# Altium project ThermoE.PrjPcb
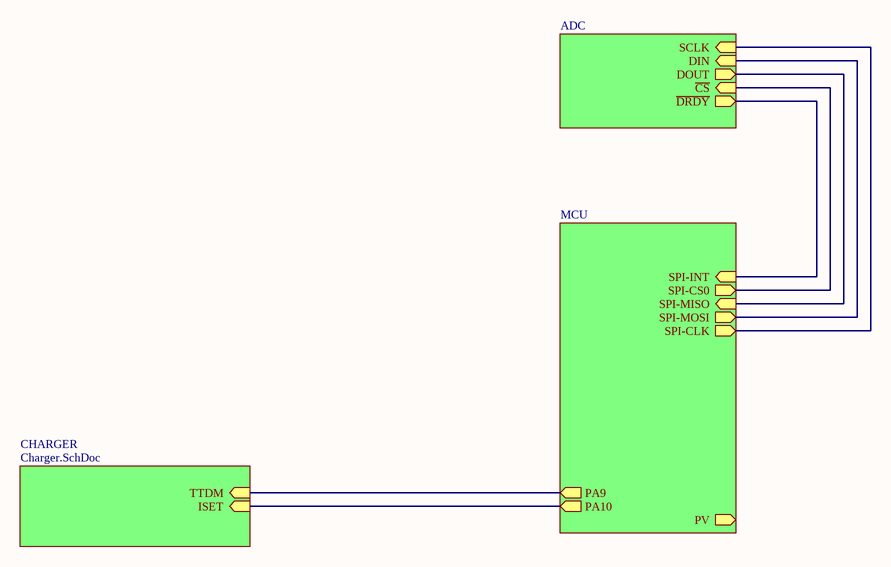
[diagram p0: MAIN.SchDoc]
4 sheets, 65 parts. Net scope: hierarchical (ports join the sheet entries above them; power ports are global).
Board file: ThermoE.PcbDoc
Sheets:
  MAIN.SchDoc
    ADC = ThermoE.SchDoc
    MCU = STM32F030C8T6.SchDoc
    CHARGER = Charger.SchDoc

## Sheet MAIN.SchDoc
size A4; SheetNumber: 1; SheetTotal: 4

### Sub-sheets
ADC = ThermoE.SchDoc: SCLK (in), DIN (in), ~{CS} (in), DOUT (out), ~{DRDY} (out)
CHARGER = Charger.SchDoc: TTDM (in), ISET (in)
MCU = STM32F030C8T6.SchDoc: SPI-MOSI (out), SPI-CS0 (out), SPI-MISO (in), SPI-CLK (out), SPI-INT (in), PV (out), PA9 (out), PA10 (out)

### Nets
ISET: sheet MCU/PA10, sheet CHARGER/ISET
SPI-CLK: sheet ADC/SCLK, sheet MCU/SPI-CLK
SPI-CS0: sheet ADC/~{CS}, sheet MCU/SPI-CS0
SPI-INT: sheet ADC/~{DRDY}, sheet MCU/SPI-INT
SPI-MISO: sheet ADC/DOUT, sheet MCU/SPI-MISO
SPI-MOSI: sheet ADC/DIN, sheet MCU/SPI-MOSI
TS: sheet MCU/PA9, sheet CHARGER/TTDM

## Sheet ThermoE.SchDoc
size A4; SheetNumber: 2; SheetTotal: 3
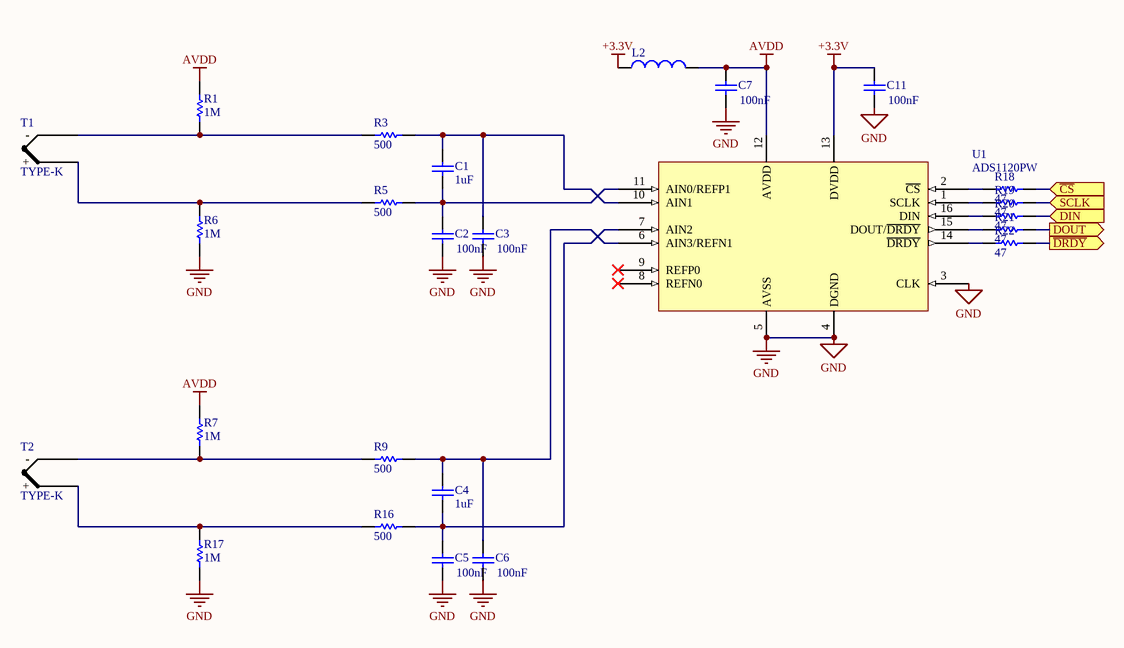
[diagram p1: ThermoE.SchDoc]

### Parts
C1  1uF  [c603]
C2  100nF  [c603]
C3  100nF  [c603]
C4  1uF  [c603]
C5  100nF  [c603]
C6  100nF  [c603]
C7  100nF  [C603]
C11  100nF  [C603]
L2  1K  [r805]  (value not drawn)
R1  1M  [R0603]
R3  500  [R0603]
R5  500  [R0603]
R6  1M  [R0603]
R7  1M  [R0603]
R9  500  [R0603]
R16  500  [R0603]
R17  1M  [R0603]
R18  47  [R0603]
R19  47  [R0603]
R20  47  [R0603]
R21  47  [R0603]
R22  47  [R0603]
T1  TYPE-K  [PCC-SMP]
T2  TYPE-K  [PCC-SMP]
U1  ADS1120PW  [TSSOP-16]

### Ports
DIN (in), DOUT (out), SCLK (in), ~{CS} (in), ~{DRDY} (out)

### Nets
+3.3V: C11.2 L2.1 U1.13(DVDD)
AVDD: C7.2 L2.2 R1.2 R7.2 U1.12(AVDD)
GND: C2.1 C3.1 C5.1 C6.1 C7.1 C11.1 R6.1 R17.1 U1.3(CLK) U1.4(DGND) U1.5(AVSS)
SPI-CLK: R19.1 ; port SCLK
SPI-CS0: R18.1 ; port ~{CS}
SPI-INT: R22.1 ; port ~{DRDY}
SPI-MISO: R21.1 ; port DOUT
SPI-MOSI: R20.1 ; port DIN
NetC1_1: C1.1 C2.2 R5.1 U1.11(AIN0/REFP1)
NetC1_2: C1.2 C3.2 R3.1 U1.10(AIN1)
NetC4_1: C4.1 C5.2 R16.1 U1.7(AIN2)
NetC4_2: C4.2 C6.2 R9.1 U1.6(AIN3/REFN1)
NetR1_1: R1.1 R3.2 T1.1(-)
NetR5_2: R5.2 R6.2 T1.2(+)
NetR7_1: R7.1 R9.2 T2.1(-)
NetR16_2: R16.2 R17.2 T2.2(+)
NetR18_2: R18.2 U1.2(~{CS})
NetR19_2: R19.2 U1.1(SCLK)
NetR20_2: R20.2 U1.16(DIN)
NetR21_2: R21.2 U1.15(DOUT/~{DRDY})
NetR22_2: R22.2 U1.14(~{DRDY})

Not connected (* = marked no-connect by the designer): U1 8(REFN0)* 9(REFP0)*

### Library data of the parts
C1-C7 C11 = Cap: Capacitor; Designer: Parsa Malekpour
  C1 C4: Value: 1uF
  C2 C3 C5-C7 C11: Value: 100nF
L2 = Ferrite Bead: Code_IEC: 1005; Published: 8-Jun-2000; LatestRevisionDate: 29-May-2009; LatestRevisionNote: IPC-7351 Footprint Added.; Publisher: Altium Limited; PackageDescription: Chip Inductor; Code_JEITA: 0402; Value: 1K
R1 R3 R5-R7 R9 R16-R22 = Resistor: Designer: Parsa Malekpour
  R1 R6 R7 R17: Value: 1M
  R3 R5 R9 R16: Value: 500
  R18-R22: Value: 47
T1 T2 = THERMOCOUPLE
U1 = ADS1120PW: ADS1120 4-Channel, 2-kSPS, Low-Power, 16-Bit ADC with Integrated PGA and Reference

## Sheet STM32F030C8T6.SchDoc
size A4; SheetNumber: 3; SheetTotal: 4
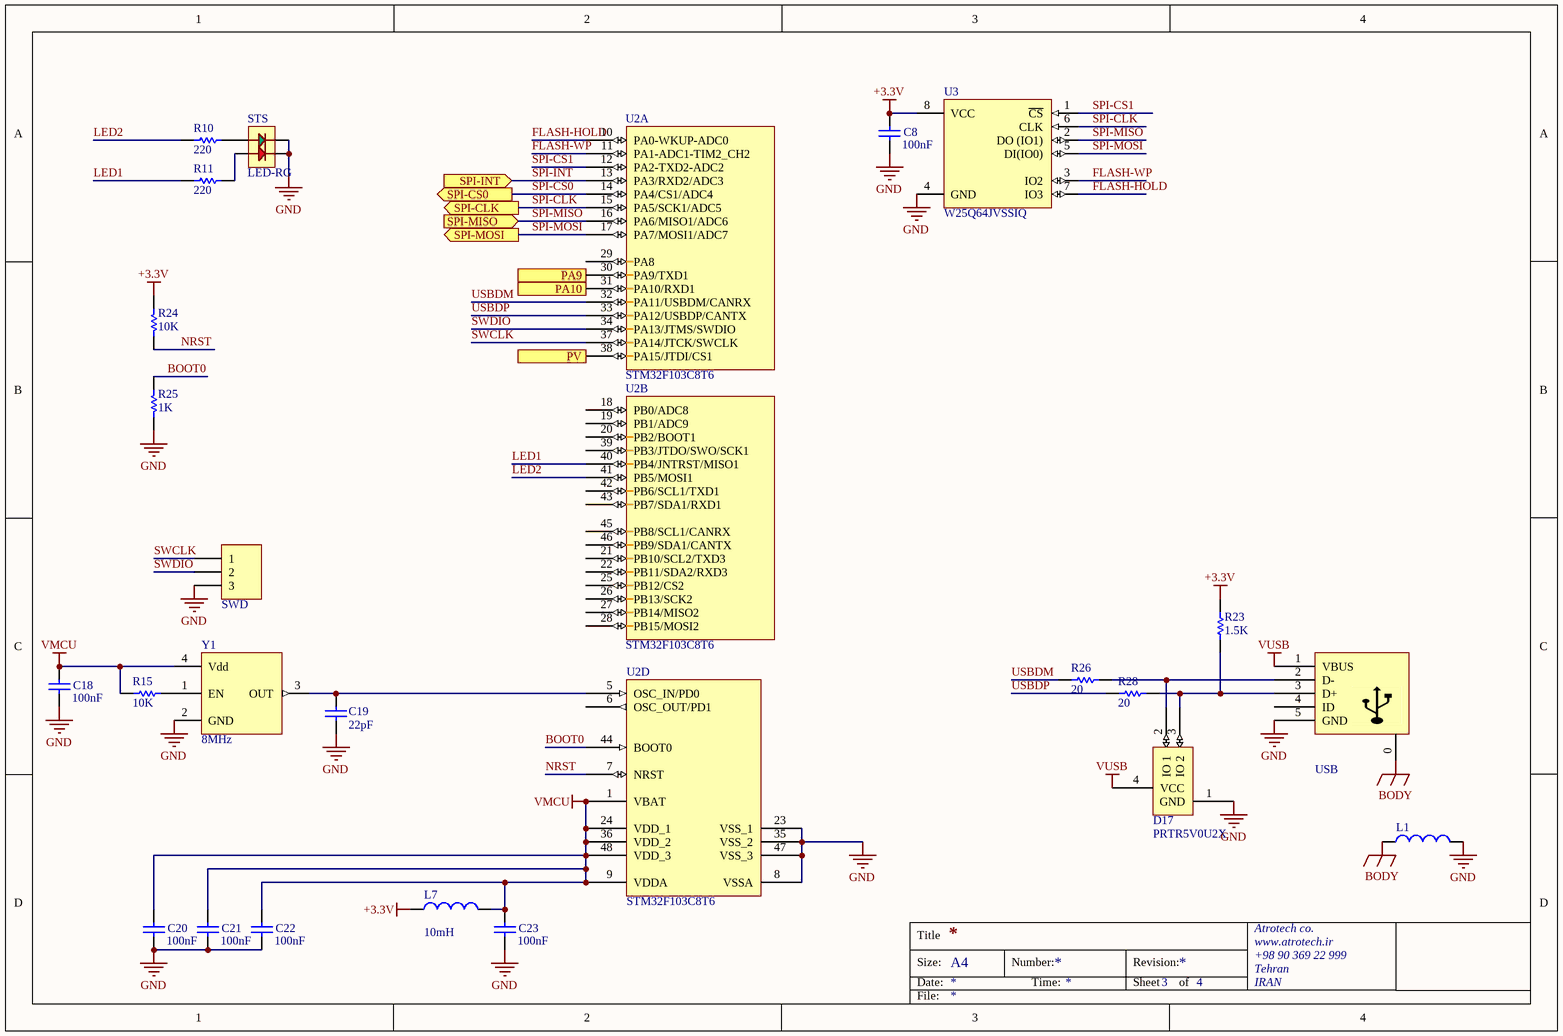
[diagram p2: STM32F030C8T6.SchDoc]

### Parts
C8  100nF  [C603]
C18  100nF  [C603]
C19  22pF  [C603]
C20  100nF  [C603]
C21  100nF  [C603]
C22  100nF  [C603]
C23  100nF  [C603]
D17  PRTR5V0U2X  [SOT-143B]
L1  Inductor  [R805]  (value not drawn)
L7  value 10mH  [R805]  (hidden comment: Inductor)
R10  220  [R0603]
R11  220  [R0603]
R15  10K  [R0603]
R23  1.5K  [R0603]
R24  10K  [R0603]
R25  1K  [R0603]
R26  20  [R0603]
R28  20  [R0603]
STS  LED-RG  [LED-1210]
SWD  CONN-3  [PHDR3]  (value not drawn)
U2  STM32F103C8T6  [LQFP-48]  (parts A,B,D of 4)
U3  W25Q64JVSSIQ  [SOIC-8W]
USB  USB MINI  [USB-MINI-SMD]  (value not drawn)
Y1  8MHz  [ASV]

### Ports
PA9 (out), PA10 (out), PV (out), SPI-CLK (out), SPI-CS0 (out), SPI-INT (in), SPI-MISO (in), SPI-MOSI (out)

### Nets
+3.3V: C8.2 L7.1 R23.1 R24.2 U3.8(VCC)
BODY: L1.1 USB.0(BODY)
GND: C8.1 C18.1 C19.2 C20.1 C21.1 C22.1 C23.1 D17.1(GND) L1.2 R25.1 STS.3(RED-C) STS.4(GRN-C) SWD.3 U2.8(VSSA) U2.23(VSS_1) U2.35(VSS_2) U2.47(VSS_3) U3.4(GND) USB.5(GND) Y1.2(GND)
VMCU: C18.2 C20.2 C21.2 C22.2 C23.2 L7.2 R15.2 U2.1(VBAT) U2.9(VDDA) U2.24(VDD_1) U2.36(VDD_2) U2.48(VDD_3) Y1.4(Vdd)
VUSB: D17.4(VCC) USB.1(VBUS)
BOOT0: R25.2 U2.44(BOOT0)
FLASH-HOLD: U2.10(PA0-WKUP-ADC0) U3.7(IO3)
FLASH-WP: U2.11(PA1-ADC1-TIM2_CH2) U3.3(IO2)
ISET: U2.31(PA10/RXD1) ; port PA10
LED1: R11.2 U2.40(PB4/JNTRST/MISO1)
LED2: R10.2 U2.41(PB5/MOSI1)
NRST: R24.1 U2.7(NRST)
SPI-CLK: U2.15(PA5/SCK1/ADC5) U3.6(CLK) ; port SPI-CLK
SPI-CS0: U2.14(PA4/CS1/ADC4) ; port SPI-CS0
SPI-CS1: U2.12(PA2-TXD2-ADC2) U3.1(~{CS})
SPI-INT: U2.13(PA3/RXD2/ADC3) ; port SPI-INT
SPI-MISO: U2.16(PA6/MISO1/ADC6) U3.2(DO_(IO1)) ; port SPI-MISO
SPI-MOSI: U2.17(PA7/MOSI1/ADC7) U3.5(DI(IO0)) ; port SPI-MOSI
SWCLK: SWD.1 U2.37(PA14/JTCK/SWCLK)
SWDIO: SWD.2 U2.34(PA13/JTMS/SWDIO)
TS: U2.30(PA9/TXD1) ; port PA9
USBDM: R26.2 U2.32(PA11/USBDM/CANRX)
USBDP: R28.2 U2.33(PA12/USBDP/CANTX)
NetC19_1: C19.1 U2.5(OSC_IN/PD0) Y1.3(OUT)
NetD17_2: D17.2(IO_1) R26.1 USB.2(D-)
NetD17_3: D17.3(IO_2) R23.2 R28.1 USB.3(D+)
NetR10_1: R10.1 STS.1(GRN-A)
NetR11_1: R11.1 STS.2(RED-A)
NetR15_1: R15.1 Y1.1(EN)
NetU2_38: U2.38(PA15/JTDI/CS1) ; port PV

Not connected (* = marked no-connect by the designer): U2 6(OSC_OUT/PD1) 18(PB0/ADC8) 19(PB1/ADC9) 20(PB2/BOOT1) 21(PB10/SCL2/TXD3) 22(PB11/SDA2/RXD3) 25(PB12/CS2) 26(PB13/SCK2) 27(PB14/MISO2) 28(PB15/MOSI2) 29(PA8) 39(PB3/JTDO/SWO/SCK1) 42(PB6/SCL1/TXD1) 43(PB7/SDA1/RXD1) 45(PB8/SCL1/CANRX) 46(PB9/SDA1/CANTX); USB 4(ID)

### Notes on the sheet
- Title
- Size:
- Date:
- A4
- Number:
- Time:
- Revision:
- Sheet
- of
- Atrotech co.
- www.atrotech.ir
- +98 90 369 22 999
- Tehran
- IRAN
- File:

### Library data of the parts
C8 C18-C23 = Cap: Capacitor; Designer: Parsa Malekpour
  C8 C18 C20-C23: Value: 100nF
  C19: Value: 22pF
D17 = PRTR5V0U2X: Ultra low capacitance double rail-to-rail ESD protection diode; reverse standoff voltage: 5.5V
L1 = Inductor: Code_IEC: 1005; Value: 10mH; Published: 8-Jun-2000; LatestRevisionDate: 29-May-2009; LatestRevisionNote: IPC-7351 Footprint Added.; PackageReference: 0402-A; Publisher: Altium Limited; PackageDescription: Chip Inductor; Code_JEITA: 0402
L7 = Inductor: Code_IEC: 1005; Published: 8-Jun-2000; LatestRevisionDate: 29-May-2009; LatestRevisionNote: IPC-7351 Footprint Added.; PackageReference: 0402-A; Publisher: Altium Limited; PackageDescription: Chip Inductor; Code_JEITA: 0402
R10 R11 R15 R23-R26 R28 = Resistor: Designer: Parsa Malekpour
  R10 R11: Value: 220
  R15 R24: Value: 10K
  R23: Value: 1.5K
  R25: Value: 1K
  R26 R28: Value: 20
STS = LED-RG-4
SWD = CONN-3: Header, 3-Pin
U2 = STM32F103C8T6: STM32 ARM-based 32-bit MCU with 64 Kbytes Flash, 48-pin LQFP, Industrial Temperature; Published: 30-May-2008; DatasheetVersion: rev6, Mar-2008; PackageVersion: Mar-2008; PackageReference: LQFP48; Publisher: Altium Limited; PackageDescription: 48-Pin Low-Profile Quad Flat Pack, 7 x 7 mm Body, 0.5 mm Pitch (LQFP48); ComponentLink1Description: Manufacturer Link; ComponentLink1URL: www.st.com/stm32; ComponentLink2Description: Datasheet; ComponentLink2URL: http://www.st.com/stonline/products/literature/ds/13587.pdf
Y1 = OSCILLATOR: Frequency: 8MHz

## Sheet Charger.SchDoc
size A; SheetNumber: 4; SheetTotal: 4
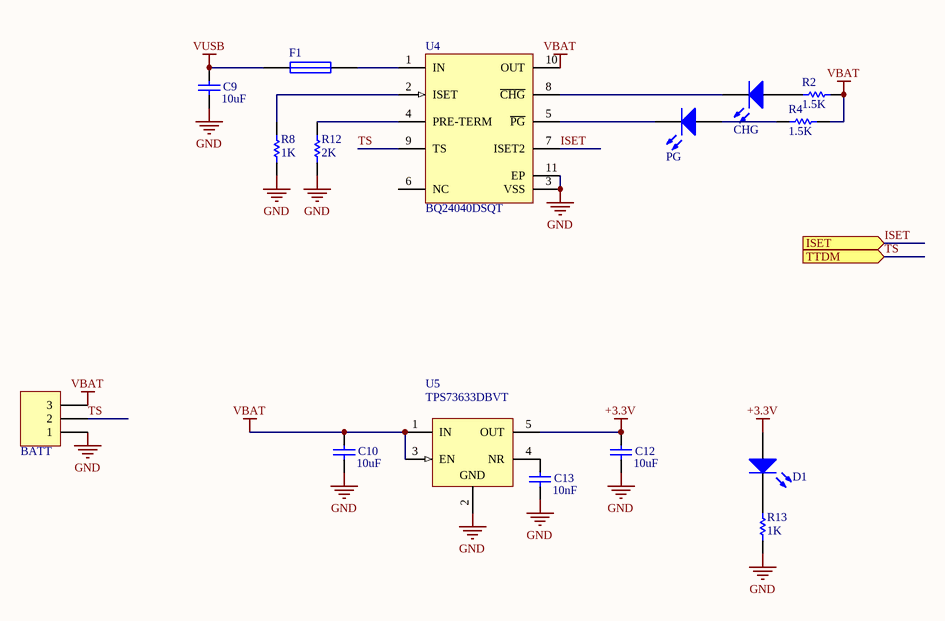
[diagram p3: Charger.SchDoc]

### Parts
BATT  CONN-3  [PicoBlade-3-S]  (value not drawn)
C9  10uF  [C805]
C10  10uF  [C805]
C12  10uF  [C805]
C13  10nF  [C603]
CHG  LED  [led-0603]  (value not drawn)
D1  LED  [led-0603]  (value not drawn)
F1  Fuse 1  [ptc-0805]  (value not drawn)
PG  LED  [led-0603]  (value not drawn)
R2  1.5K  [R0603]
R4  1.5K  [R0603]
R8  1K  [R0603]
R12  2K  [R0603]
R13  1K  [R0603]
U4  BQ24040DSQT  [SON40P200X200X80-11N]
U5  TPS73633DBVT  [DBV0005A_M]

### Ports
ISET (in), TTDM (in)

### Nets
+3.3V: C12.2 D1.1(A) U5.5(OUT)
GND: BATT.1 C9.1 C10.1 C12.1 C13.1 R8.2 R12.2 R13.2 U4.3(VSS) U4.11(EP) U5.2(GND)
VBAT: BATT.3 C10.2 R2.2 R4.2 U4.10(OUT) U5.1(IN) U5.3(EN)
VUSB: C9.2 F1.1
ISET: U4.7(ISET2) ; port ISET
TS: BATT.2 U4.9(TS) ; port TTDM
NetC13_2: C13.2 U5.4(NR)
NetCHG_1: CHG.1(A) R2.1
NetCHG_2: CHG.2(K) U4.8(~{CHG})
NetD1_2: D1.2(K) R13.1
NetF1_2: F1.2 U4.1(IN)
NetPG_1: PG.1(A) R4.1
NetPG_2: PG.2(K) U4.5(~{PG})
NetR8_1: R8.1 U4.2(ISET)
NetR12_1: R12.1 U4.4(PRE-TERM)

Not connected (* = marked no-connect by the designer): U4 6(NC)

### Library data of the parts
BATT = CONN-3: Header, 3-Pin
C9 C10 C12 C13 = Cap: Capacitor; Designer: Parsa Malekpour
  C9 C10 C12: Value: 10uF
  C13: Value: 10nF
F1 = Fuse 1: Fuse; Published: 8-Jun-2000; LatestRevisionDate: 17-Jul-2002; LatestRevisionNote: Re-released for DXP Platform.; PackageReference: PIN-W2/E2.8; Publisher: Altium Limited; PackageDescription: Thru-Hole; 2 Leads
R2 R4 R8 R12 R13 = Resistor: Designer: Parsa Malekpour
  R2 R4: Value: 1.5K
  R8 R13: Value: 1K
  R12: Value: 2K
U4 = CMP-0321-00457-2: 800 mA, Single-Input, Single Cell Li-Ion Battery Charger with Auto Start. Vovp=6.6 V, 3.5 V, -40 to 85 degC, 10-pin SON (DSQ), Green (RoHS & no Sb/Br); Manufacturer: Texas Instruments; Lead Acid: N; SubFamily: Battery Charge Management; Vin(Min)(V): 3.5; PackageReference: DSQ0010A; NiMH: N; DatasheetVersion: SLUS941A; Over Voltage Protection: N; PackageDescription: 10-Pin Plastic Small Outline No-Lead, 2 x 2 x 0.8 mm Body, 0.4 mm Pitch, Exposed Pad; Li-Polymer: N; Li-Ion: N; ComponentLink1Description: Datasheet; ComponentLink1URL: http://www.ti.com/general/docs/lit/getliterature.tsp?genericPartNumber=BQ24040&fileType=pdf; PartNumber: BQ24040DSQT; NiCd: N; Eco-Plan: Green (RoHS & no Sb/Br); Mounting Technology: Surface Mount; PackageVersion: revB, Apr-2010
U5 = CMP-0395-00251-2: Single Output Low Noise LDO, 400 mA, Fixed 3.3 V Output, 1.7 to 5.5 V Input, with Reverse Current Protection, 5-pin SOT-23 (DBV), -40 to 85 degC, Green (RoHS & no Sb/Br); Manufacturer: Texas Instruments; Vin(Min)(V): 1.7; Vin(Max)(V): 5.5; Vout Adj(Min)(V): 3.3; Accuracy(%): 1; SubFamily: Single Channel LDO; Rating: Catalog; Iout(Max)(A): 0.4; Iq(Typ)(mA): 0.3; Vdo(Typ)(mV): 75; ComponentLink1URL: http://www.ti.com/; ComponentLink4URL: Samples URL:http://www.ti.com/product/tps73633#samples; ComponentLink2Description: Datasheet; ComponentLink3URL: http://www.ti.com/litv/pdf/mpds018i; Code_JEDEC: MO-178; ComponentLink4Description: URL Link1; Eco-Plan: Green (RoHS & no Sb/Br); PartNumber: TPS73633DBVT; PackageVersion: 4073253-4/K; ComponentLink2URL: http://www.ti.com/general/docs/lit/getliterature.tsp?genericPartNumber=TPS73633&fileType=pdf; Fixed Output Options(V): 3.3; Mounting Technology: Surface Mount; PackageDescription: 5-Pin Plastic Small Outline, Body 1.60 Ãƒâ€” 2.90 mm, Pitch 0.95 mm; DatasheetVersion: SBVS038T; Vout Adj(Max)(V): 3.3; ComponentLink1Description: Manufacturer URL; ComponentLink3Description: Package Specification; PackageReference: DBV0005A

## Nets that join several sheets
+3.3V: ThermoE (C11.2 L2.1 U1.13), STM32F030C8T6 (5 pins), Charger (C12.2 D1.1 U5.5)
GND: ThermoE (11 pins), STM32F030C8T6 (20 pins), Charger (11 pins)
VUSB: STM32F030C8T6 (D17.4 USB.1), Charger (C9.2 F1.1)
ISET: STM32F030C8T6 (U2.31), Charger (U4.7)
SPI-CLK: ThermoE (R19.1), STM32F030C8T6 (U2.15 U3.6)
SPI-CS0: ThermoE (R18.1), STM32F030C8T6 (U2.14)
SPI-INT: ThermoE (R22.1), STM32F030C8T6 (U2.13)
SPI-MISO: ThermoE (R21.1), STM32F030C8T6 (U2.16 U3.2)
SPI-MOSI: ThermoE (R20.1), STM32F030C8T6 (U2.17 U3.5)
TS: STM32F030C8T6 (U2.30), Charger (BATT.2 U4.9)